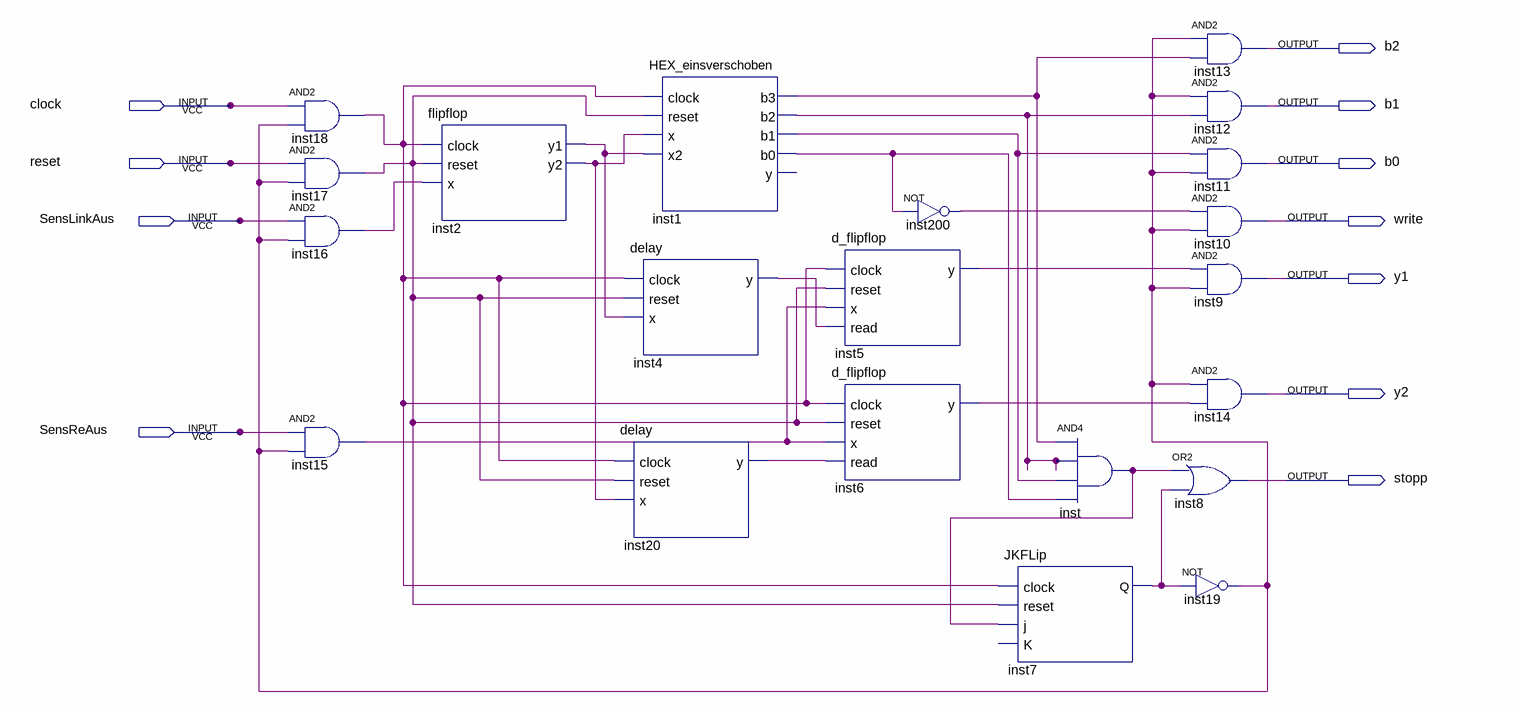
[diagram p0: schematic sheet]
// Quartus schematic einlesen.bdf as structural Verilog: 21 symbols, 11 pins
module einlesen (
  input  clock,
  input  reset,
  input  SensLinkAus,
  input  SensReAus,
  output b2,
  output b1,
  output b0,
  output write,
  output y1,
  output y2,
  output stopp
);

  wire inst1_b0, inst1_b1, inst1_b2, inst1_b3, inst2_y1, inst2_y2, inst4_y, inst5_y, inst6_y, inst7_q,
       inst15_out, inst16_out, inst17_out, inst18_out, inst19_out, inst20_y, inst200_out, inst_out;

  and inst18 (inst18_out, clock, inst19_out);
  and inst17 (inst17_out, reset, inst19_out);
  and inst16 (inst16_out, SensLinkAus, inst19_out);
  and inst15 (inst15_out, SensReAus, inst19_out);
  flipflop inst2 (.clock(inst18_out), .reset(inst17_out), .x(inst16_out), .y1(inst2_y1), .y2(inst2_y2));
  HEX_einsverschoben inst1 (
    .clock(inst18_out), .reset(inst17_out), .x(inst2_y2), .x2(inst2_y1), .b3(inst1_b3), .b2(inst1_b2),
    .b1(inst1_b1), .b0(inst1_b0));  // open: y
  delay inst4 (.clock(inst18_out), .reset(inst17_out), .x(inst2_y1), .y(inst4_y));
  delay inst20 (.clock(inst18_out), .reset(inst17_out), .x(inst2_y2), .y(inst20_y));
  d_flipflop inst5 (.clock(inst18_out), .reset(inst17_out), .x(inst15_out), .read(inst4_y), .y(inst5_y));
  d_flipflop inst6 (.clock(inst18_out), .reset(inst17_out), .x(inst15_out), .read(inst20_y), .y(inst6_y));
  not inst200 (inst200_out, inst1_b0);
  JKFLip inst7 (.clock(inst18_out), .reset(inst17_out), .j(inst_out), .Q(inst7_q));  // open: K
  and inst (inst_out, inst1_b3, inst1_b2, inst1_b1, inst1_b0);
  or inst8 (stopp, inst_out, inst7_q);
  not inst19 (inst19_out, inst7_q);
  and inst13 (b2, inst19_out, inst1_b3);
  and inst12 (b1, inst19_out, inst1_b2);
  and inst11 (b0, inst1_b1, inst19_out);
  and inst10 (write, inst200_out, inst19_out);
  and inst9 (y1, inst5_y, inst19_out);
  and inst14 (y2, inst19_out, inst6_y);
endmodule
